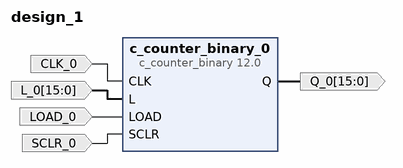
[diagram p0: block diagram of the top level]
# Vivado block design design_1, xc7a35tftg256-1, Vivado 2020.1
create_bd_design design_1

create_bd_port -dir I -type clk CLK_0
set_property -dict {CONFIG.FREQ_HZ 10000000} [get_bd_ports CLK_0]
create_bd_port -dir I -from 15 -to 0 -type data L_0
create_bd_port -dir I -type data LOAD_0
create_bd_port -dir O -from 15 -to 0 -type data Q_0
create_bd_port -dir I -type rst SCLR_0
set_property -dict {CONFIG.POLARITY ACTIVE_HIGH} [get_bd_ports SCLR_0]

create_bd_cell -type ip -vlnv xilinx.com:ip:c_counter_binary:12.0 c_counter_binary_0
set_property -dict {CONFIG.Load true CONFIG.SCLR true} [get_bd_cells c_counter_binary_0]

# ---- connections ----

connect_bd_net -net CLK_0_1 [get_bd_ports CLK_0] [get_bd_pins c_counter_binary_0/CLK]
connect_bd_net -net L_0_1 [get_bd_ports L_0] [get_bd_pins c_counter_binary_0/L]
connect_bd_net -net LOAD_0_1 [get_bd_ports LOAD_0] [get_bd_pins c_counter_binary_0/LOAD]
connect_bd_net [get_bd_pins c_counter_binary_0/Q] [get_bd_ports Q_0]
connect_bd_net -net SCLR_0_1 [get_bd_ports SCLR_0] [get_bd_pins c_counter_binary_0/SCLR]

validate_bd_design
save_bd_design
